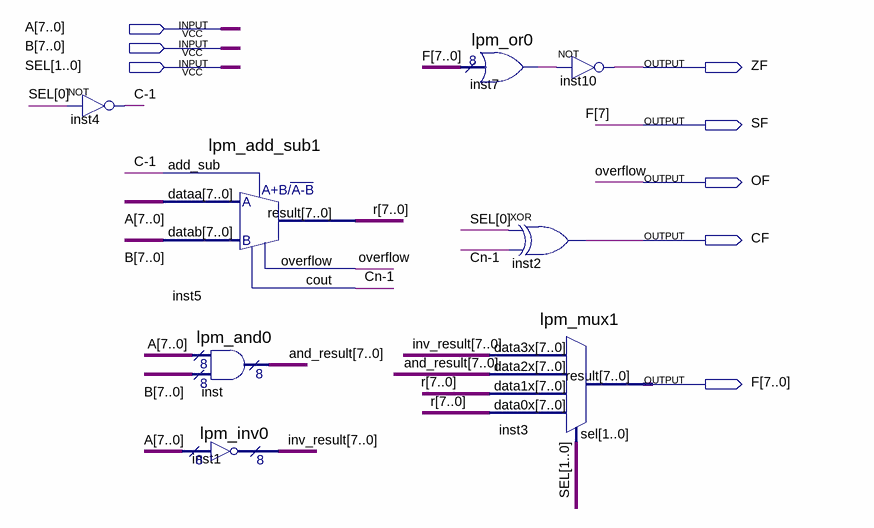
[diagram p0: schematic sheet]
// Quartus schematic ALU.bdf as structural Verilog: 8 symbols, 8 pins
module ALU (
  input  [7:0] A,
  input  [7:0] B,
  input  [1:0] SEL,
  output ZF,
  output SF,
  output OF,
  output CF,
  output [7:0] F
);

  wire \C-1 , \Cn-1 , inst7_result;
  wire [7:0] and_result, inv_result, r;

  not inst4 (\C-1 , SEL[0]);
  lpm_add_sub1 inst5 (.dataa(A), .datab(B), .add_sub(\C-1 ), .result(r), .overflow(OF), .cout(\Cn-1 ));
  lpm_and0 inst (.data0x(A), .data1x(B), .result(and_result));
  lpm_inv0 inst1 (.data(A), .result(inv_result));
  lpm_or0 inst7 (.data(F), .result(inst7_result));
  xor inst2 (CF, SEL[0], \Cn-1 );
  lpm_mux1 inst3 (.data3x(inv_result), .data2x(and_result), .data1x(r), .data0x(r), .sel(SEL), .result(F));
  not inst10 (ZF, inst7_result);

  assign SF = F[7];

  // Other names for the same wires on the sheet: overflow = OF
endmodule
